# Altium schematic sheet Sheet_1.schdoc
size 385 x 212 mm
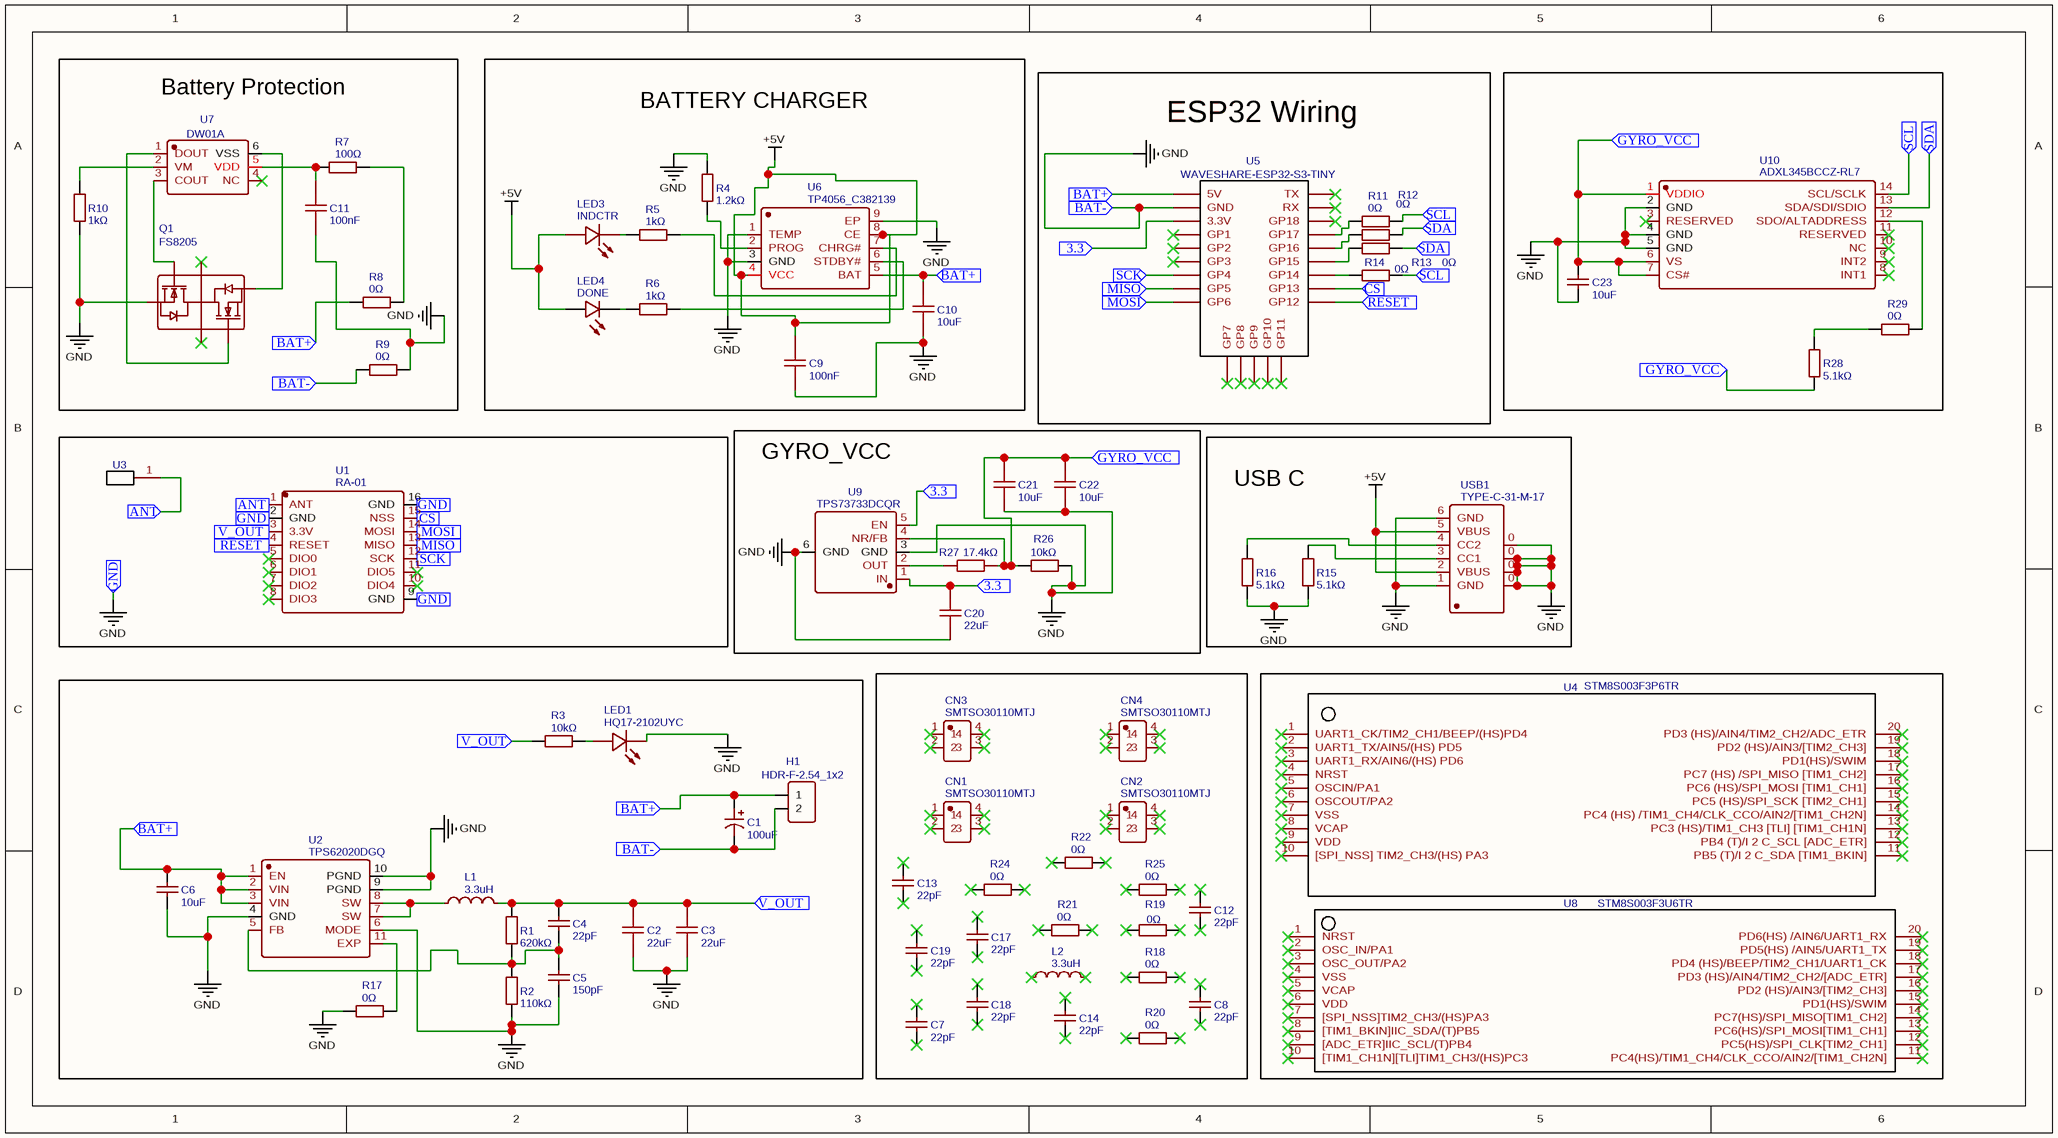
[diagram p0: Sheet_1.schdoc]

## Parts
C1  100uF  [CAP-SMD_BD6.3-L6.6-W6.6-LS7.2-FD]
C2  22uF  [C0603]
C3  22uF  [C0603]
C4  22pF  [C0603]
C5  150pF  [C0603]
C6  10uF  [C0603]
C7  22pF  [C0603]
C8  22pF  [C0603]
C9  100nF  [C0603]
C10  10uF  [C0603]
C11  100nF  [C0603]
C12  22pF  [C0603]
C13  22pF  [C0603]
C14  22pF  [C0603]
C17  22pF  [C0603]
C18  22pF  [C0603]
C19  22pF  [C0603]
C20  22uF  [C0603]
C21  10uF  [C0603]
C22  10uF  [C0603]
C23  10uF  [C0603]
CN1  SMTSO30110MTJ  [SCREW-SMD_BD5.6-D4.1-H11_1]
CN2  SMTSO30110MTJ  [SCREW-SMD_BD5.6-D4.1-H11_1]
CN3  SMTSO30110MTJ  [SCREW-SMD_BD5.6-D4.1-H11_1]
CN4  SMTSO30110MTJ  [SCREW-SMD_BD5.6-D4.1-H11_1]
H1  HDR-F-2.54_1x2  [HDR-F-2.54_1X2]
L1  3.3uH  [IND-SMD_L7.2-W6.6_GPSR07X0]
L2  3.3uH  [IND-SMD_L7.2-W6.6_GPSR07X0]
LED1  HQ17-2102UYC  [LED0805-RD]
LED3  INDCTR  [LED0603-RD]
LED4  DONE  [LED0603-RD]
Q1  FS8205  [SOT-23-6_L2.9-W1.6-P0.95-LS2.8-BR]
R1  620kΩ  [R0603]
R2  110kΩ  [R0603]
R3  10kΩ  [R0603]
R4  1.2kΩ  [R0603]
R5  1kΩ  [R0603]
R6  1kΩ  [R0603]
R7  100Ω  [R0603]
R8  0Ω  [R0603]
R9  0Ω  [R0603]
R10  1kΩ  [R0603]
R11  0Ω  [R0603]
R12  0Ω  [R0603]
R13  0Ω  [R0603]
R14  0Ω  [R0603]
R15  5.1kΩ  [R0603]
R16  5.1kΩ  [R0603]
R17  0Ω  [R0603]
R18  0Ω  [R0603]
R19  0Ω  [R0603]
R20  0Ω  [R0603]
R21  0Ω  [R0603]
R22  0Ω  [R0603]
R24  0Ω  [R0603]
R25  0Ω  [R0603]
R26  10kΩ  [R0603]
R27  17.4kΩ  [R0603]
R28  5.1kΩ  [R0603]
R29  0Ω  [R0603]
U1  RA-01  [WIRELM-SMD_RA-01]
U2  TPS62020DGQ  [MSOP-10_L3.0-W3.0-P0.50-LS5.0-BL-EP]
U3  1 PAD  [PADPAD]  (value not drawn)
U4  STM8S003F3P6TR  [TSSOP-20_L6.5-W4.4-P0.65-LS6.4-BL]
U5  WAVESHARE-ESP32-S3-TINY  [WAVESHARE-ESP32-S3-TINY]
U6  TP4056_C382139  [ESOP-8_L4.9-W3.9-P1.27-LS6.0-BL-EP]
U7  DW01A  [SOT-23-6_L2.9-W1.6-P0.95-LS2.8-BR]
U8  STM8S003F3U6TR  [UFQFPN-20_L3.0-W3.0-P0.50-TL]
U9  TPS73733DCQR  [SOT-223-6_L6.5-W3.5-P1.27-BL]
U10  ADXL345BCCZ-RL7  [LGA-14_L5.0-W3.0-P0.80-BL]
USB1  TYPE-C-31-M-17  [USB-C-SMD_10P-P1.00-L6.8-W8.9]

## Blocks framed on the sheet
Battery Protection: C11 Q1 R7-R10 U7
BATTERY CHARGER: C9 C10 LED3 LED4 R4-R6 U6
ESP32 Wiring: R11-R14 U5
GYRO_VCC: C20-C22 R26 R27 U9
USB C: R15 R16 USB1

## Ports
3.3 (in), ANT (in), BAT+ (in), BAT- (in), CS (in), GND (in), GYRO_VCC (in), MISO (in), MOSI (in), RESET (in), SCK (in), SCL (in), SDA (in), V_OUT (in)

## Nets
+5V: C9.2 LED3.2(A) LED4.2(A) U6.4(VCC) U6.8(CE) USB1.2(VBUS) USB1.5(VBUS)
GND: C1.2 C2.1 C3.1 C5.1 C6.1 C9.1 C10.2 C11.2 C20.1 C21.1 C22.1 C23.1 H1.2 LED1.1(K) Q1.1(S1) R2.1 R4.2 R9.1 R9.2 R10.2 R15.1 R16.1 R17.1 R26.2 U1.2(GND) U1.9(GND) U1.16(GND) U2.4(GND) U2.6(MODE) U2.9(PGND) U2.10(PGND) U5.2(GND) U6.1(TEMP) U6.3(GND) U6.9(EP) U9.3(GND) U9.6(GND) U10.2(GND) U10.4(GND) U10.5(GND) USB1.0 USB1.1(GND) USB1.6(GND) ; port GND, port BAT-
3.3: C20.2 U5.3(3.3V) U9.1(IN) U9.5(EN) ; port 3.3
ANT: U1.1(ANT) U3.1(Pad) ; port ANT
BAT+: C1.1 C6.2 C10.1 H1.1 R8.1 U2.1(EN) U2.2(VIN) U2.3(VIN) U5.1(5V) U6.5(BAT) ; port BAT+
CS: U1.15(NSS) U5.16(GP13) ; port CS
GYRO_VCC: C21.2 C22.2 C23.2 R26.1 R27.2 R28.1 U9.4(NR/FB) U10.1(VDDIO) U10.6(VS) U10.7(CS#) ; port GYRO_VCC
MISO: U1.13(MISO) U5.8(GP5) ; port MISO
MOSI: U1.14(MOSI) U5.9(GP6) ; port MOSI
RESET: U1.4(RESET) U5.15(GP12) ; port RESET
SCK: U1.12(SCK) U5.7(GP4) ; port SCK
SCL: R11.2 R14.2 U10.14(SCL/SCLK) ; port SCL
SDA: R12.2 R13.2 U10.13(SDA/SDI/SDIO) ; port SDA
V_OUT: C2.2 C3.2 C4.1 L1.2 R1.2 R3.1 U1.3(3.3V) ; port V_OUT
NetC4_2: C4.2 C5.2 R1.1 R2.2 U2.5(FB)
NetC11_1: C11.1 R7.1 U7.5(VDD)
NetL1_1: L1.1 U2.7(SW) U2.8(SW)
NetLED1_2: LED1.2(A) R3.2
NetLED3_1: LED3.1(K) R5.1
NetLED4_1: LED4.1(C) R6.1
NetQ1_3: Q1.3(S2) U7.6(VSS)
NetQ1_4: Q1.4(G2) U7.1(DOUT)
NetQ1_6: Q1.6(G1) U7.3(COUT)
NetR4_1: R4.1 U6.2(PROG)
NetR5_2: R5.2 U6.7(CHRG#)
NetR6_2: R6.2 U6.6(STDBY#)
NetR7_2: R7.2 R8.2
NetR10_1: R10.1 U7.2(VM)
NetR11_1: R11.1 U5.20(GP17)
NetR12_1: R12.1 U5.19(GP16)
NetR13_1: R13.1 U5.18(GP15)
NetR14_1: R14.1 U5.17(GP14)
NetR15_2: R15.2 USB1.3(CC1)
NetR16_2: R16.2 USB1.4(CC2)
NetR17_2: R17.2 U2.11(EXP)
NetR27_1: R27.1 U9.2(OUT)
NetR28_2: R28.2 R29.1
NetR29_2: R29.2 U10.12(SDO/ALTADDRESS)

Not connected (* = marked no-connect by the designer): C7 1* 2*; C8 1* 2*; C12 1* 2*; C13 1* 2*; C14 1* 2*; C17 1* 2*; C18 1* 2*; C19 1* 2*; CN1 1* 2* 3* 4*; CN2 1* 2* 3* 4*; CN3 1* 2* 3* 4*; CN4 1* 2* 3* 4*; L2 1* 2*; Q1 2(D12)* 5(D12)*; R18 1* 2*; R19 1* 2*; R20 1* 2*; R21 1* 2*; R22 1* 2*; R24 1* 2*; R25 1* 2*; U1 5(DIO0)* 6(DIO1)* 7(DIO2)* 8(DIO3)* 10(DIO4)* 11(DIO5)*; U4 1(UART1_CK/TIM2_CH1/BEEP/(HS)PD4)* 2(UART1_TX/AIN5/(HS)_PD5)* 3(UART1_RX/AIN6/(HS)_PD6)* 4(NRST)* 5(OSCIN/PA1)* 6(OSCOUT/PA2)* 7(VSS)* 8(VCAP)* 9(VDD)* 10([SPI_NSS]_TIM2_CH3/(HS)_PA3)* 11(PB5_(T)/I_2_C_SDA_[TIM1_BKIN])* 12(PB4_(T)/I_2_C_SCL_[ADC_ETR])* 13(PC3_(HS)/TIM1_CH3_[TLI]_[TIM1_CH1N])* 14(PC4_(HS)_/TIM1_CH4/CLK_CCO/AIN2/[TIM1_CH2N])* 15(PC5_(HS)/SPI_SCK_[TIM2_CH1])* 16(PC6_(HS)/SPI_MOSI_[TIM1_CH1])* 17(PC7_(HS)_/SPI_MISO_[TIM1_CH2])* 18(PD1(HS)/SWIM)* 19(PD2_(HS)/AIN3/[TIM2_CH3])* 20(PD3_(HS)/AIN4/TIM2_CH2/ADC_ETR)*; U5 4(GP1)* 5(GP2)* 6(GP3)* 10(GP7)* 11(GP8)* 12(GP9)* 13(GP10)* 14(GP11)* 21(GP18)* 22(RX)* 23(TX)*; U7 4(NC)*; U8 1(NRST)* 2(OSC_IN/PA1)* 3(OSC_OUT/PA2)* 4(VSS)* 5(VCAP)* 6(VDD)* 7([SPI_NSS]TIM2_CH3/(HS)PA3)* 8([TIM1_BKIN]IIC_SDA/(T)PB5)* 9([ADC_ETR]IIC_SCL/(T)PB4)* 10([TIM1_CH1N][TLI]TIM1_CH3/(HS)PC3)* 11(PC4(HS)/TIM1_CH4/CLK_CCO/AIN2/[TIM1_CH2N])* 12(PC5(HS)/SPI_CLK[TIM2_CH1])* 13(PC6(HS)/SPI_MOSI[TIM1_CH1])* 14(PC7(HS)/SPI_MISO[TIM1_CH2])* 15(PD1(HS)/SWIM)* 16(PD2_(HS)/AIN3/[TIM2_CH3])* 17(PD3_(HS)/AIN4/TIM2_CH2/[ADC_ETR])* 18(PD4_(HS)/BEEP/TIM2_CH1/UART1_CK)* 19(PD5(HS)_/AIN5/UART1_TX)* 20(PD6(HS)_/AIN6/UART1_RX)*; U10 3(RESERVED)* 8(INT1)* 9(INT2)* 10(NC)* 11(RESERVED)*

## Library data of the parts
C1 = 100uF: Manufacturer: KNSCHA(科尼盛); Manufacturer Part: RVT100UF16V67RV0016; nameAlias: Value; Contributor: LCSC; Supplier: LCSC; Supplier Part: C2887276; JLCPCB Part Class: Extended Part; spicePre: C; spiceSymbolName: RVT100UF16V67RV0016
C2 C3 C20 = 22uF: Manufacturer: SAMSUNG(三星); Manufacturer Part: CL10A226MQ8NRNC; nameAlias: Value; Supplier: LCSC; Supplier Part: C59461; JLCPCB Part Class: Basic Part; spicePre: C; spiceSymbolName: CL10A226MQ8NRNC
C4 C7 C8 C12-C14 C17-C19 = 22pF: Manufacturer Part: CL10C220JB8NNNC; Manufacturer: SAMSUNG(三星); nameAlias: Value; Supplier: LCSC; Supplier Part: C1653; JLCPCB Part Class: Basic Part; spicePre: C; spiceSymbolName: CL10C220JB8NNNC
C5 = 150pF: Manufacturer Part: CL10C151JB8NNNC; Manufacturer: SAMSUNG(三星); nameAlias: Value; Supplier: LCSC; Supplier Part: C37298; JLCPCB Part Class: Extended Part; spicePre: C; spiceSymbolName: CL10C151JB8NNNC
C6 C23 = 10uF: Manufacturer: SAMSUNG(三星); Manufacturer Part: CL10A106MO8NQNC; nameAlias: Value; Supplier: LCSC; Supplier Part: C92487; JLCPCB Part Class: Extended Part; spicePre: C; spiceSymbolName: CL10A106MO8NQNC
C9 C11 = 100nF: Manufacturer: YAGEO(国巨); Manufacturer Part: CC0603KRX7R9BB104; nameAlias: Value; Supplier: LCSC; Supplier Part: C14663; JLCPCB Part Class: Basic Part; spicePre: C; spiceSymbolName: CC0603KRX7R9BB104
C10 C21 C22 = 10uF: Manufacturer: SAMSUNG(三星); Manufacturer Part: CL10A106KP8NNNC; nameAlias: Value; Supplier: LCSC; Supplier Part: C19702; JLCPCB Part Class: Basic Part; spicePre: C; spiceSymbolName: CL10A106KP8NNNC
CN1-CN4 = SMTSO30110MTJ: Manufacturer: Sinhoo(雄和远景); Manufacturer Part: SMTSO30110MTJ-B; Contributor: lcsc; Supplier: LCSC; Supplier Part: C2916371; JLCPCB Part Class: Extended Part; spicePre: C; spiceSymbolName: SMTSO30110MTJ
H1 = HDR-F-2.54_1x2: Contributor: LCEDA_Lib; Supplier Part: C49661; Supplier: LCSC; spicePre: H; spiceSymbolName: HDR-F-2.54_1x2
L1 L2 = 3.3uH: Manufacturer: SHOU HAN(首韩); Manufacturer Part: CYA0630-3.3UH; Contributor: lcsc; nameAlias: Value; Supplier: LCSC; Supplier Part: C5189747; JLCPCB Part Class: Extended Part; spicePre: L; spiceSymbolName: CYA0630-3.3UH
LED1 = HQ17-2102UYC: Manufacturer: HARVATEK; Contributor: LCSC; Supplier: LCSC; Manufacturer Part: HQ17-2102UYC; Supplier Part: C154488; spicePre: L; spiceSymbolName: HQ17-2102UYC
LED3 = INDCTR: Manufacturer: KENTO; Manufacturer Part: KT-0603R; Supplier: LCSC; Supplier Part: C2286; JLCPCB Part Class: Basic Part; spicePre: L; spiceSymbolName: KT-0603R
LED4 = DONE: Manufacturer: EVERLIGHT(亿光); Manufacturer Part: 19-217/GHC-YR1S2/3T; Supplier: LCSC; Supplier Part: C72043; JLCPCB Part Class: Extended Part; spicePre: L; spiceSymbolName: 19-217/GHC-YR1S2/3T
Q1 = FS8205: Manufacturer: FORTUNE(富晶); Supplier: LCSC; Manufacturer Part: FS8205; Supplier Part: C32254; JLCPCB Part Class: Extended Part; spicePre: Q; spiceSymbolName: FS8205
R1 = 620kΩ: Manufacturer: UNI-ROYAL(厚声); Manufacturer Part: 0603WAF6203T5E; nameAlias: Value; Supplier: LCSC; Supplier Part: C23219; JLCPCB Part Class: Extended Part; spicePre: R; spiceSymbolName: 0603WAF6203T5E
R2 = 110kΩ: Manufacturer: UNI-ROYAL(厚声); Manufacturer Part: 0603WAF1103T5E; nameAlias: Value; Supplier: LCSC; Supplier Part: C25805; JLCPCB Part Class: Extended Part; spicePre: R; spiceSymbolName: 0603WAF1103T5E
R3 R26 = 10kΩ: Manufacturer: YAGEO(国巨); Manufacturer Part: RC0603FR-0710KL; nameAlias: Value; Supplier: LCSC; Supplier Part: C98220; JLCPCB Part Class: Extended Part; spicePre: R; spiceSymbolName: RC0603FR-0710KL
R4 = 1.2kΩ: Manufacturer: UNI-ROYAL(厚声); Manufacturer Part: 0603WAF1201T5E; nameAlias: Value; Supplier: LCSC; Supplier Part: C22765; JLCPCB Part Class: Basic Part; spicePre: R; spiceSymbolName: 0603WAF1201T5E
R5 R6 R10 = 1kΩ: Manufacturer: UNI-ROYAL(厚声); Manufacturer Part: 0603WAF1001T5E; nameAlias: Value; Supplier: LCSC; Supplier Part: C21190; JLCPCB Part Class: Basic Part; spicePre: R; spiceSymbolName: 0603WAF1001T5E
R7 = 100Ω: Manufacturer: UNI-ROYAL(厚声); Manufacturer Part: 0603WAF1000T5E; nameAlias: Value; Supplier: LCSC; Supplier Part: C22775; JLCPCB Part Class: Basic Part; spicePre: R; spiceSymbolName: 0603WAF1000T5E
R8 R9 R17-R22 R24 R25 R29 = 0Ω: Manufacturer: YAGEO(国巨); Manufacturer Part: RC0603JR-070RL; nameAlias: Value; Supplier: LCSC; Supplier Part: C95177; JLCPCB Part Class: Extended Part; spicePre: R; spiceSymbolName: RC0603JR-070RL
R11-R14 = 0Ω: Manufacturer: UNI-ROYAL(厚声); Manufacturer Part: 0603WAF0000T5E; nameAlias: Value; Supplier: LCSC; Supplier Part: C21189; JLCPCB Part Class: Basic Part; spicePre: R; spiceSymbolName: 0603WAF0000T5E
R15 R16 R28 = 5.1kΩ: Manufacturer Part: 0603WAF5101T5E; Manufacturer: UNI-ROYAL(厚声); nameAlias: Value; Supplier: LCSC; Supplier Part: C23186; JLCPCB Part Class: Basic Part; spicePre: R; spiceSymbolName: 0603WAF5101T5E
R27 = 17.4kΩ: Manufacturer: YAGEO(国巨); Manufacturer Part: RC0603FR-0717K4L; nameAlias: Value; Contributor: LCSC; Supplier: LCSC; Supplier Part: C185365; JLCPCB Part Class: Extended Part; spicePre: R; spiceSymbolName: RC0603FR-0717K4L
U1 = RA-01: Manufacturer: Ai-Thinker; Contributor: LCSC; Supplier: LCSC; Supplier Part: C90040; Manufacturer Part: Ra-01; JLCPCB Part Class: Extended Part; spicePre: U; spiceSymbolName: RA-01
U2 = TPS62020DGQ: Manufacturer: TI(德州仪器); Contributor: LCSC; Supplier: LCSC; Manufacturer Part: TPS62020DGQ; Supplier Part: C139339; JLCPCB Part Class: Extended Part; spicePre: U; spiceSymbolName: TPS62020DGQ
U3 = 1 PAD: Contributor: CGK2412; Supplier Part: C5160222; Supplier: LCSC; spicePre: U; spiceSymbolName: 1 PAD
U4 = STM8S003F3P6TR: Manufacturer: ST(意法半导体); Supplier: LCSC; Manufacturer Part: STM8S003F3P6TR; Supplier Part: C52717; JLCPCB Part Class: Extended Part; spicePre: U; spiceSymbolName: STM8S003F3P6TR
U5 = WAVESHARE-ESP32-S3-TINY: Manufacturer Part: ESP32-S3 Mini Development Board; Contributor: Mohammed Jerjawi; Manufacturer: WAVESHARE; Supplier: WAVESHARE; link: https://www.waveshare.com/product/esp32-s3-tiny.htm; spicePre: U; spiceSymbolName: WAVESHARE-ESP32-S3-TINY
U6 = TP4056_C382139: Manufacturer: TPOWER(天源); Manufacturer Part: TP4056; Contributor: LCSC; Supplier: LCSC; Supplier Part: C382139; JLCPCB Part Class: Extended Part; spicePre: U; spiceSymbolName: TP4056_C382139
U7 = DW01A: Manufacturer: HL(富海微); Contributor: lcsc; Supplier: LCSC; Supplier Part: C18164398; Manufacturer Part: DW01A; JLCPCB Part Class: Extended Part; spicePre: U; spiceSymbolName: DW01A_C18164398
U8 = STM8S003F3U6TR: Manufacturer: ST(意法半导体); Contributor: 立创EDA官方封装库; Supplier: LCSC; Manufacturer Part: STM8S003F3U6TR; Supplier Part: C35556; JLCPCB Part Class: Extended Part; spicePre: U; spiceSymbolName: STM8S003F3U6TR
U9 = TPS73733DCQR: Manufacturer: TI(德州仪器); Supplier: LCSC; Manufacturer Part: TPS73733DCQR; Supplier Part: C31334; JLCPCB Part Class: Extended Part; spicePre: U; spiceSymbolName: TPS73733DCQR
U10 = ADXL345BCCZ-RL7: Manufacturer: ADI(亚德诺); Supplier: LCSC; Manufacturer Part: ADXL345BCCZ-RL7; Supplier Part: C9667; JLCPCB Part Class: Extended Part; spicePre: U; spiceSymbolName: ADXL345BCCZ-RL7
USB1 = TYPE-C-31-M-17: Manufacturer: 韩国韩荣; Contributor: LCSC; Supplier: LCSC; Supplier Part: C283540; Manufacturer Part: TYPE-C-31-M-17; JLCPCB Part Class: Extended Part; link: https://lcsc.com/eda_search?q=C283540&%26type=1&ref=editor; spicePre: U; spiceSymbolName: TYPE-C-31-M-17